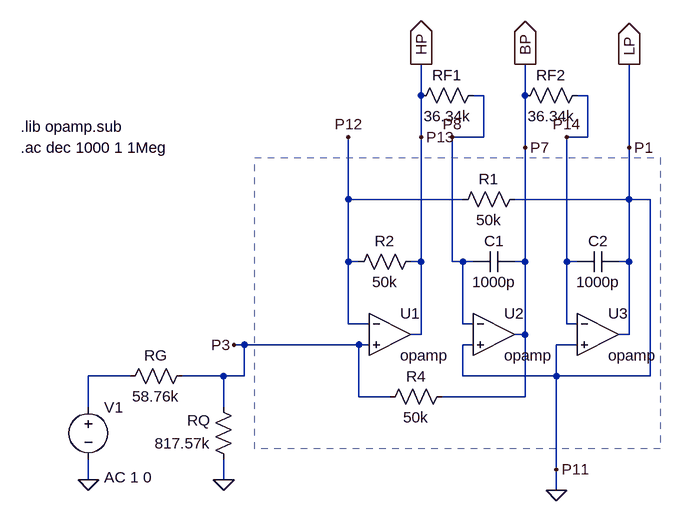
[diagram p0: schematic SimulacionLTSpice.asc]
SimulacionLTSpice.asc, the LTspice schematic file:
Version 4
SHEET 1 880 680
WIRE 112 -176 112 -224
WIRE 208 -176 192 -176
WIRE 272 -176 272 -224
WIRE 368 -176 352 -176
WIRE 112 -112 112 -176
WIRE 208 -112 208 -176
WIRE 208 -112 160 -112
WIRE 368 -112 368 -176
WIRE 368 -112 336 -112
WIRE 272 -96 272 -176
WIRE 432 -96 432 -224
WIRE 0 -16 0 -112
WIRE 176 -16 0 -16
WIRE 432 -16 432 -96
WIRE 432 -16 256 -16
WIRE 464 -16 432 -16
WIRE 0 80 0 -16
WIRE 16 80 0 80
WIRE 112 80 112 -112
WIRE 112 80 96 80
WIRE 160 80 160 -112
WIRE 176 80 160 80
WIRE 192 80 176 80
WIRE 272 80 272 -96
WIRE 272 80 256 80
WIRE 336 80 336 -112
WIRE 352 80 336 80
WIRE 432 80 432 -16
WIRE 432 80 416 80
WIRE 0 176 0 80
WIRE 32 176 0 176
WIRE 176 176 176 80
WIRE 192 176 176 176
WIRE 336 176 336 80
WIRE 352 176 336 176
WIRE 112 192 112 80
WIRE 112 192 96 192
WIRE 272 192 272 80
WIRE 272 192 256 192
WIRE 432 192 432 80
WIRE 432 192 416 192
WIRE -160 208 -176 208
WIRE 16 208 -160 208
WIRE 32 208 16 208
WIRE 192 208 176 208
WIRE 352 208 320 208
WIRE -336 256 -400 256
WIRE -192 256 -256 256
WIRE -160 256 -160 208
WIRE -160 256 -192 256
WIRE 176 256 176 208
WIRE 320 256 320 208
WIRE 320 256 176 256
WIRE 464 256 464 -16
WIRE 464 256 320 256
WIRE 16 288 16 208
WIRE 64 288 16 288
WIRE 272 288 272 192
WIRE 272 288 144 288
WIRE -400 304 -400 256
WIRE -192 304 -192 256
WIRE 320 400 320 256
WIRE -400 416 -400 384
WIRE -192 416 -192 384
WIRE 320 432 320 400
FLAG 320 432 0
FLAG -176 208 P3
FLAG -400 416 0
FLAG -192 416 0
FLAG 320 400 P11
FLAG 0 -112 P12
FLAG 112 -112 P13
FLAG 160 -112 P8
FLAG 272 -96 P7
FLAG 336 -112 P14
FLAG 432 -96 P1
FLAG 112 -224 HP
IOPIN 112 -224 Out
FLAG 272 -224 BP
IOPIN 272 -224 Out
FLAG 432 -224 LP
IOPIN 432 -224 Out
SYMBOL OpAmps\\opamp 64 128 R0
SYMATTR InstName U1
SYMBOL OpAmps\\opamp 224 128 R0
SYMATTR InstName U2
SYMBOL OpAmps\\opamp 384 128 R0
SYMATTR InstName U3
SYMBOL res 112 64 R90
WINDOW 0 0 56 VBottom 2
WINDOW 3 32 56 VTop 2
SYMATTR InstName R2
SYMATTR Value 50k
SYMBOL cap 256 64 R90
WINDOW 0 0 32 VBottom 2
WINDOW 3 32 32 VTop 2
SYMATTR InstName C1
SYMATTR Value 1000p
SYMBOL cap 416 64 R90
WINDOW 0 0 32 VBottom 2
WINDOW 3 32 32 VTop 2
SYMATTR InstName C2
SYMATTR Value 1000p
SYMBOL res 160 272 R90
WINDOW 0 0 56 VBottom 2
WINDOW 3 32 56 VTop 2
SYMATTR InstName R4
SYMATTR Value 50k
SYMBOL res -240 240 R90
WINDOW 0 0 56 VBottom 2
WINDOW 3 32 56 VTop 2
SYMATTR InstName RG
SYMATTR Value 58.76k
SYMBOL res -176 400 R180
WINDOW 0 36 76 Left 2
WINDOW 3 36 40 Left 2
SYMATTR InstName RQ
SYMATTR Value 817.57k
SYMBOL voltage -400 288 R0
WINDOW 123 24 124 Left 2
WINDOW 39 0 0 Left 0
SYMATTR Value2 AC 1 0
SYMATTR InstName V1
SYMATTR Value ""
SYMBOL res 272 -32 R90
WINDOW 0 0 56 VBottom 2
WINDOW 3 32 56 VTop 2
SYMATTR InstName R1
SYMATTR Value 50k
SYMBOL res 368 -192 R90
WINDOW 0 0 56 VBottom 2
WINDOW 3 32 56 VTop 2
SYMATTR InstName RF2
SYMATTR Value 36.34k
SYMBOL res 208 -192 R90
WINDOW 0 0 56 VBottom 2
WINDOW 3 32 56 VTop 2
SYMATTR InstName RF1
SYMATTR Value 36.34k
TEXT -504 -128 Left 2 !.lib opamp.sub
TEXT -504 -96 Left 2 !.ac dec 1000 1 1Meg
RECTANGLE Normal 480 368 -144 -80 2

The netlist it stands for:
* SimulacionLTSpice.asc
XU1 P12 P3 HP opamp Aol=100K GBW=10Meg  ; pins invin noninvin out
XU2 P8 0 BP opamp Aol=100K GBW=10Meg  ; pins invin noninvin out
XU3 P14 0 0 opamp Aol=100K GBW=10Meg  ; pins invin noninvin out
R2 HP P12 50k
C1 BP P8 1000p
C2 0 P14 1000p
R4 BP P3 50k
RG P3 N001 58.76k
RQ 0 P3 817.57k
V1 N001 0 AC 1 0
R1 0 P12 50k
RF2 P14 BP 36.34k
RF1 P8 HP 36.34k
.lib opamp.sub
.ac dec 1000 1 1Meg
.backanno
.end